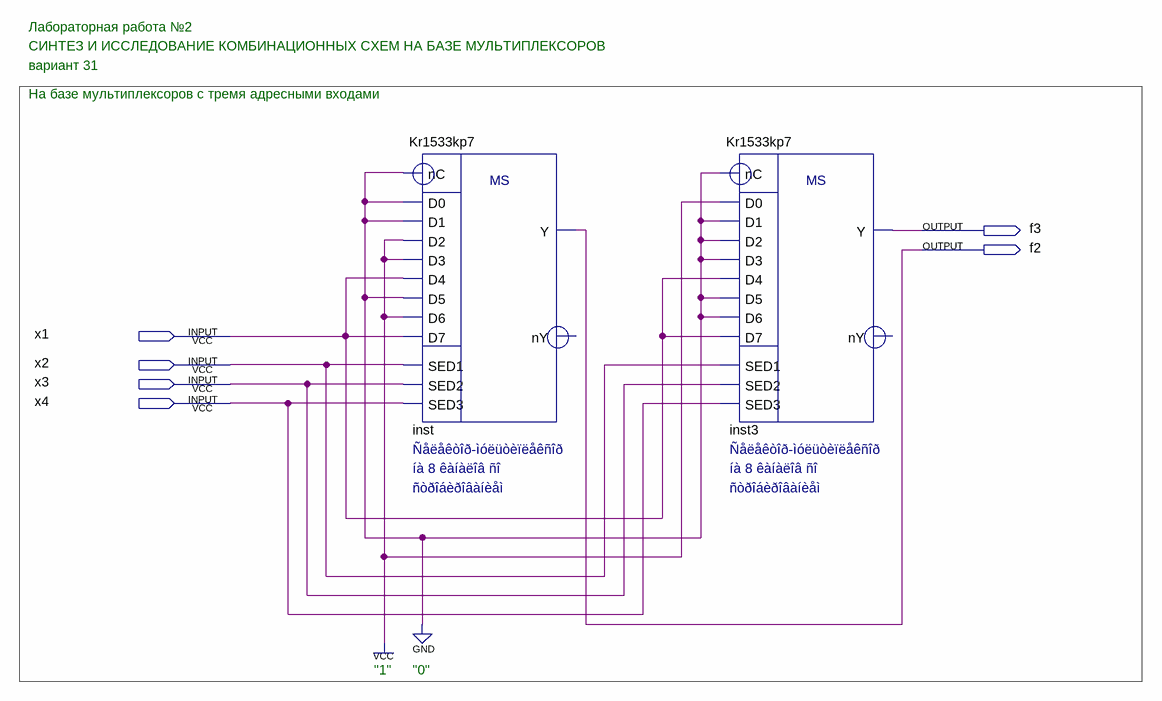
[diagram p0: schematic sheet]
// Quartus schematic 2_MUX_with_3_adress_input.bdf as structural Verilog: 2 symbols, 6 pins
module \2_MUX_with_3_adress_input  (
  input  x1,
  input  x2,
  input  x3,
  input  x4,
  output f3,
  output f2
);

  Kr1533kp7 inst (
    .nC(1'b0), .D0(1'b0), .D1(1'b0), .D2(1'b1), .D3(1'b1), .D4(x1), .D5(1'b0), .D6(1'b1), .D7(x1), .SED1(x2),
    .SED2(x3), .SED3(x4), .Y(f2));  // open: nY
  Kr1533kp7 inst3 (
    .nC(1'b0), .D0(1'b1), .D1(1'b0), .D2(1'b0), .D3(1'b0), .D4(x1), .D5(1'b0), .D6(1'b0), .D7(x1), .SED1(x2),
    .SED2(x3), .SED3(x4), .Y(f3));  // open: nY

  // Notes on the sheet:
  //   Лабораторная работа №2
  //   СИНТЕЗ И ИССЛЕДОВАНИЕ КОМБИНАЦИОННЫХ СХЕМ НА БАЗЕ МУЛЬТИПЛЕКСОРОВ
  //   вариант 31
  //   На базе мультиплексоров с тремя адресными входами
  //   "1"
  //   "0"
endmodule
